# EasyEDA Pro project SN74LVC1G86.eprj

# Schematic Schematic1
Board Name: Board1; Create Date: 2025-07-17; Page Name: P1; Project Name: SN74LVC1G86; Schematic Name: Schematic1; Update Date: 2025-07-17; Page Size: A4; Version: V1.0
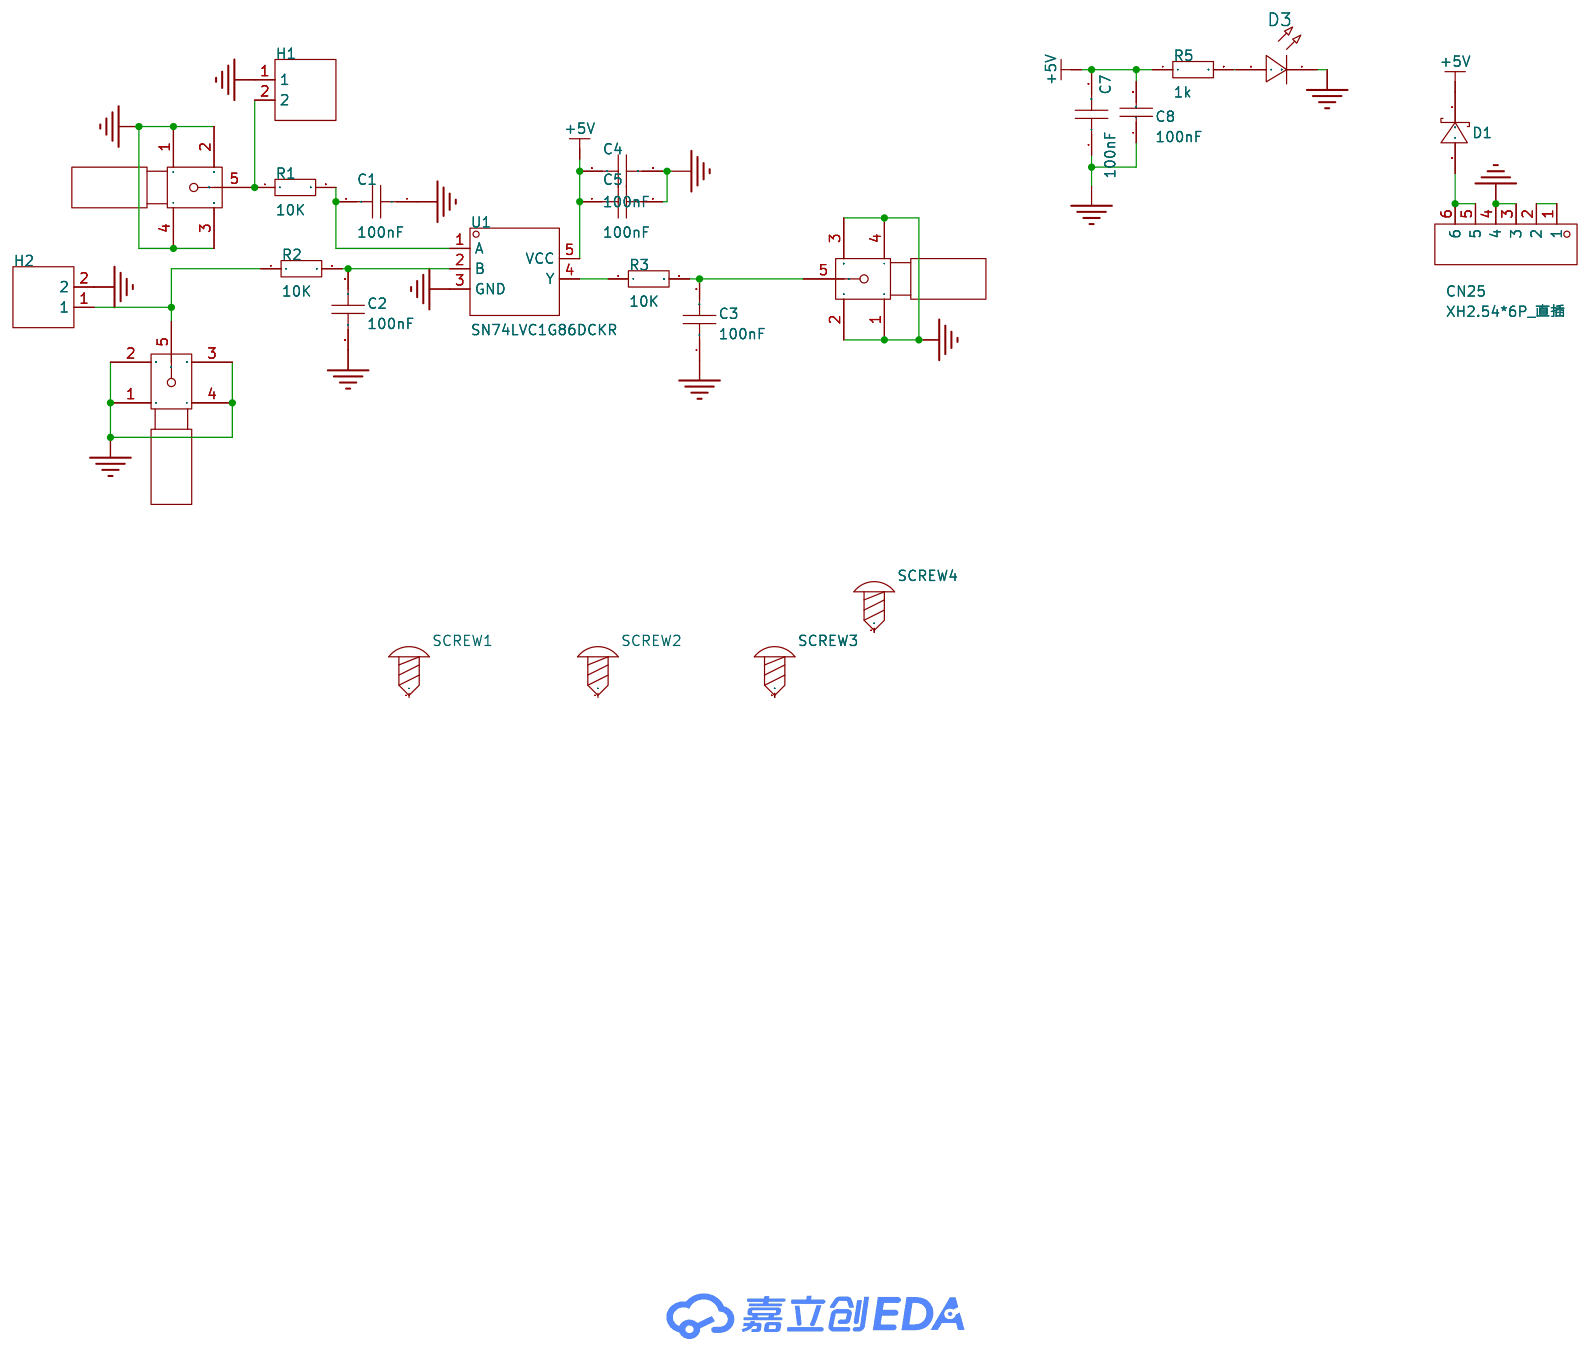
[diagram p0: schematic sheet]

## Parts
C1  100nF  [R0805]
C2  100nF  [R0805]
C3  100nF  [R0805]
C4  100nF  [R0805]
C5  100nF  [R0805]
C7  100nF  [R0805]
C8  100nF  [C1210]
CN25  XH2.54*6P_直插  [CONN-TH_XH2.54-6P]
D1  SD103AWS  [SOD-323_L1.8-W1.3-LS2.5-RD]
D3  -  [LED_0805]
H1  -  [HDR-TH_2P-P2.54-V-M-1]
H2  -  [HDR-TH_2P-P2.54-V-M-1]
R1  10K  [R0805]
R2  10K  [R0805]
R3  10K  [R0805]
R5  1k  [R0805]
SCREW1  -  [M3螺丝]
SCREW2  -  [M3螺丝]
SCREW3  -  [M3螺丝]
SCREW4  -  [M3螺丝]
U1  SN74LVC1G86DCKR  [SC-70-5_L2.1-W1.3-P0.65-LS2.1-BR]
U17  -  [SMA]
U18  -  [SMA]
U19  -  [SMA]

## Library data of the parts
C1-C5 C7 = CAP_0805: Supplier Footprint: 0805
C8 = CL32B106KAJNNNE: 容值:10uF;精度:±10%;额定电压:25V;材质(温度系数):X7R;; LCSC Part Name: 10uF ±10% 25V; Supplier Part: C39232; Manufacturer: SAMSUNG(三星); Supplier Footprint: 1210; JLCPCB Part Class: 扩展库; Datasheet: https://atta.szlcsc.com/upload/public/pdf/source/20160218/1457707763339.pdf; Supplier: LCSC; Tolerance: ±10%; Voltage Rated: 25V; Temperature Coefficient: X7R
CN25 = XH2.54*6P_直插: Supplier Part: C9900008614; Supplier Footprint: XH2.54_6P; JLCPCB Part Class: 扩展库; Supplier: LCSC
D1 = SD103AWS_C181207: 正向压降(Vf):600mV@200mA;直流反向耐压(Vr):40V;整流电流:350mA;; LCSC Part Name: 电压:40V 电流:350mA 丝印S4; Supplier Part: C181207; Manufacturer: Hottech(合科泰); Supplier Footprint: SOD-323; JLCPCB Part Class: 扩展库; Datasheet: https://atta.szlcsc.com/upload/public/pdf/source/20240513/4691873FBB9173EFBCF4C6FD4BBA1025.pdf; Supplier: LCSC; Forward Voltage (Vf@If): 600mV@200mA; Reverse Voltage (Vr): 40V; Rectified Current: 350mA
D3 = LED_0805-R: Supplier Footprint: 0805
H1 H2 = HDR-M_2.54_1x2P: Supplier Part: C124375; Supplier Footprint: 插件
R1-R3 R5 = Res_0805: Supplier Footprint: 0805
SCREW1-SCREW4 = M3螺丝: Supplier Footprint: 插件
U1 = SN74LVC1G86DCKR: 逻辑类型:异或门;通道数:1;工作电压:1.65V~5.5V;静态电流(Iq):10uA;传播延迟(tpd):4ns@5V,50pF;; Supplier Part: C52350; Manufacturer: TI(德州仪器); Supplier Footprint: SC-70-5; JLCPCB Part Class: 扩展库; Datasheet: https://www.ti.com/cn/lit/gpn/sn74lvc1g86; Supplier: LCSC; Logic Type: 异或门; Number of Channels: 1; Voltage - Supply: 1.65V~5.5V; Quiescent Current: 10uA; Current - Output Low(IOL): 32mA; Current - Output High(IOH): 32mA; Input Logic Level - High: 1.7V~2V; Input Logic Level - Low: 700mV~800mV; Series: 74LVC系列; Propagation Delay: 4ns@5V,50pF; Operating Temperature: -40℃~+125℃
U17-U19 = SMA

## Nets
+5V: C4.1 C5.1 C7.2 C8.2 D1.1(C) R5.1 U1.5(VCC)
GND: C1.1 C2.2 C3.1 C4.2 C5.2 C7.1 C8.1 CN25.3 CN25.4 D3.1(C) H1.1 H2.2 U1.3(GND) U17.1 U17.2 U17.3 U17.4 U18.1 U18.2 U18.3 U18.4 U19.1 U19.2 U19.3 U19.4
$1N324: C2.1 R2.2 U1.2(B)
$1N330: C1.2 R1.2 U1.1(A)
$1N554: R3.1 U1.4(Y)
$1N558: C3.2 R3.2 U19.5
$1N1165: D3.2(A) R5.2
$1N1169: CN25.5 CN25.6 D1.2(A)
$1N1171: CN25.1 CN25.2
$1N1227: H1.2 R1.1 U17.5
$1N1279: H2.1 R2.1 U18.5

Not connected (* = marked no-connect by the designer): SCREW1 1; SCREW2 1; SCREW3 1; SCREW4 1

# Board PCB1
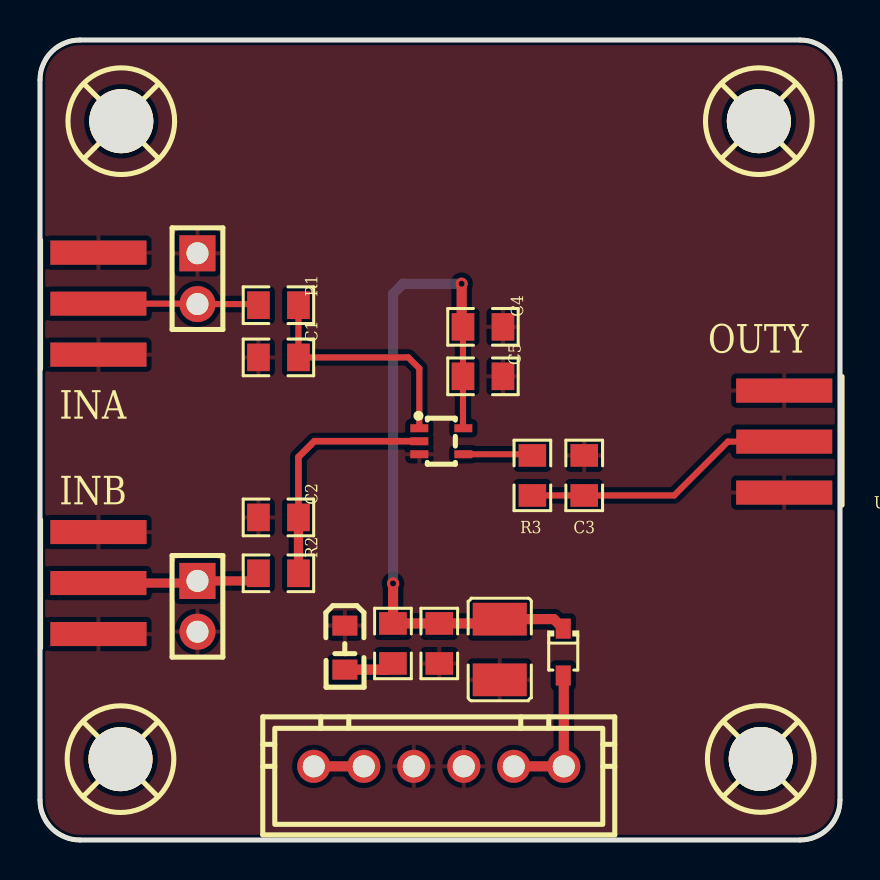
[diagram p1: board, top side]
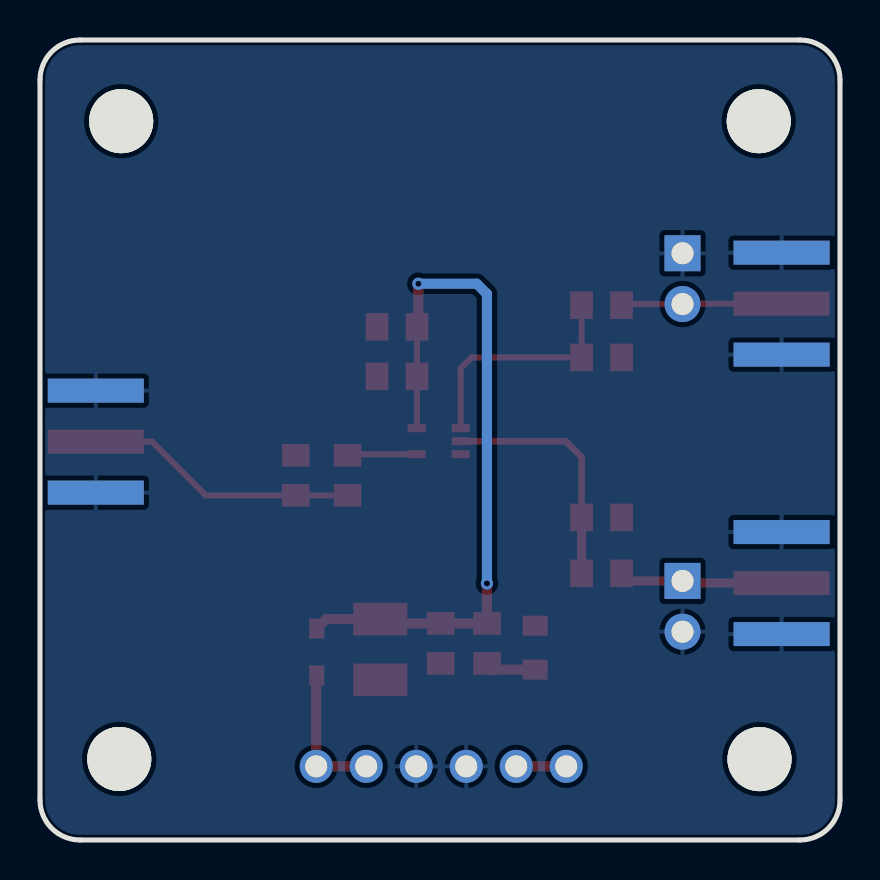
[diagram p2: board, bottom side, seen from below]

Outline 40 x 40 mm; copper layers: Top Layer, Bottom Layer. Coordinates in mm from the lower left corner of the outline.
Outline path: 0,38 0,2 arc(0.59,0.59) 2,0 38,0 arc(39.41,0.59) 40,2 40,38 arc(39.41,39.41) 38,40 2,40 arc(0.59,39.41) 0,38
Stack: Top Layer 0.035mm / Dielectric1 1.51mm FR4 er 4.5 / Bottom Layer 0.035mm

## Design rules (mm)
template: JLCPCB Capability(Two Layers Board)
spacing copperThickness1oz (default): track to track 0.102, other pairs 0.152 to 0.3
spacing copperThickness2oz: track to track 0.203, other pairs 0.152 to 0.3
track width copperThickness1oz (default): min 0.127, default 0.254, max 2.54
track width copperThickness2oz: min 0.203, default 0.254, max 2.54
differential pair differentialPair (default): width min 0.127, default 0.254, max 2.54; gap min 0.152, default 0.152
via viaSize (default): diameter min 0.5, default 0.61, max 10; hole min 0.3, default 0.305, max 6.3

## Placement (name value [footprint] x y rotation side)
C1  100nF  [R0805#2]  12.03 24.13 0 top
C2  100nF  [R0805#2]  11.81 16.13 180 top
C3  100nF  [R0805#2]  27.21 18.12 270 top
C4  100nF  [R0805#2]  22.26 25.66 0 top
C5  100nF  [R0805#2]  22.26 23.18 0 top
C7  100nF  [R0805#2]  19.96 9.94 90 top
C8  100nF  [C1210]  22.99 9.53 90 top
CN25  XH2.54*6P_直插  [CONN-TH_XH2.54-6P]  19.94 3.68 0 top
D1  SD103AWS  [SOD-323_L1.8-W1.3-LS2.5-RD]  26.16 9.4 270 top
D3  -  [LED_0805]  15.24 9.57 270 top
H1  -  [HDR-TH_2P-P2.54-V-M-1]  7.87 28.07 270 top
H2  -  [HDR-TH_2P-P2.54-V-M-1]  7.87 11.68 270 top
R1  10K  [R0805]  11.92 26.74 0 top
R2  10K  [R0805]  11.92 13.33 0 top
R3  10K  [R0805]  24.62 18.23 270 top
R5  1k  [R0805]  17.65 9.83 270 top
SCREW1  -  [M3螺丝]  4.06 35.94 0 top
SCREW2  -  [M3螺丝]  35.94 35.94 0 top
SCREW3  -  [M3螺丝]  36.04 4.05 0 top
SCREW4  -  [M3螺丝]  4.03 4.04 0 top
U1  SN74LVC1G86DCKR  [SC-70-5_L2.1-W1.3-P0.65-LS2.1-BR]  20.07 19.94 180 top
U17  -  [SMA]  -0.89 20.95 0 top
U18  -  [SMA]  -0.89 6.98 0 top
U19  -  [SMA]  41.02 25.78 180 top

## Footprints (pads in the part's own frame, mm; a bottom-side part is the same pattern mirrored in y, then rotated)
C1210
  rect 1.635x2.7 smd: 1(-1.518,0) 2(1.518,0)
CONN-TH_XH2.54-6P
  round 1.65 hole 1.1: 1(-6.25,0) 2(-3.75,0) 3(-1.25,0) 4(1.25,0) 5(3.75,0) 6(6.25,0)
HDR-TH_2P-P2.54-V-M-1
  rect 1.8x1.8 hole 1.1: 1(-1.27,0)
  round 1.8 hole 1.1: 2(1.27,0)
LED_0805
  rect 1x1.25 smd: 1(-1.15,0.005) 2(1.05,0.005)
M3螺丝
  round 3.2 hole 3.2: 1(0,0)
R0805
  rect 1.133x1.377 smd: 1(-1,0) 2(1,0)
R0805#2
  rect 1.133x1.377 smd: 1(-1.111,0) 2(0.889,0)
SC-70-5_L2.1-W1.3-P0.65-LS2.1-BR
  rect 0.9x0.4 smd: 1(1.1,-0.65) 2(1.1,0) 3(1.1,0.65) 4(-1.1,0.65) 5(-1.1,-0.65)
SMA
  rect 4.8x1.2 smd: 1(3.81,8.412) 2(3.81,3.312) 5(3.81,5.862)
  rect 4.8x1.2 smd far side: 3(3.81,3.312) 4(3.81,8.412)
SOD-323_L1.8-W1.3-LS2.5-RD
  rect 1x0.75 smd: 1(-1.173,0) 2(1.173,0)

## Nets
As in the schematic.

Pads without a net: SCREW1 1; SCREW2 1; SCREW3 1; SCREW4 1

## Via types
v1: diameter 0.61, hole 0.305, Top Layer to Bottom Layer, 2 vias

## Routing (per net, layer and track width the routed paths; a pad name or vN(x,y) marks a point on that pad's centre or on a via; arc(x,y) is an arc through that point)
+5V: length 36.2
  Top Layer w0.305: U1.5 21.15,20.61 C5.1 C4.1
  Top Layer w0.508: C4.1 21.08,25.72 v1(21.08,27.81) ; v1(17.65,12.83) 17.65,10.83 R5.1 C7.2 22.77,10.83 C8.2 25.69,11.04 D1.1
  Bottom Layer w0.508: v1(17.65,12.83) 17.65,27.31 18.16,27.81 v1(21.08,27.81)
$1N324: length 12.2
  Top Layer w0.33: U1.2 13.72,19.94 12.92,19.14 C2.1
  Top Layer w0.457: R2.2 C2.1
$1N330: length 11.9
  Top Layer w0.305: U1.1 18.97,23.58 18.41,24.13 C1.2 R1.2
$1N554: length 3.5
  Top Layer w0.305: U1.4 24.56,19.29 R3.1
$1N558: length 13.7
  Top Layer w0.305: 37.21,19.92 34.4,19.92 31.71,17.23 C3.2 R3.2
$1N1165: length 2.5
  Top Layer w0.508: D3.2 17.34,8.52 R5.2
$1N1169: length 7.1
  Top Layer w0.508: D1.2 26.19,8.2 CN25.6 CN25.5
$1N1171: length 2.5
  Top Layer w0.508: CN25.2 CN25.1
$1N1227: length 8
  Top Layer w0.305: R1.1 10.87,26.8 H1.2 7.85,26.82 U17.5
$1N1279: length 8.2
  Top Layer w0.457: U18.5 7.77,12.85 H2.1 10.54,12.95 R2.1

## Copper pours and planes (outline as drawn; the poured copper is in the pictures)
GND on Top Layer: -10.03,49.53 47.75,49.53 47.75,-21.84 -10.03,-21.84
GND on Bottom Layer: -3.3,44.45 45.34,44.45 45.34,-12.83 -3.3,-12.83

## Text on the board
Top Silkscreen Layer: INA | INB | OUTY
